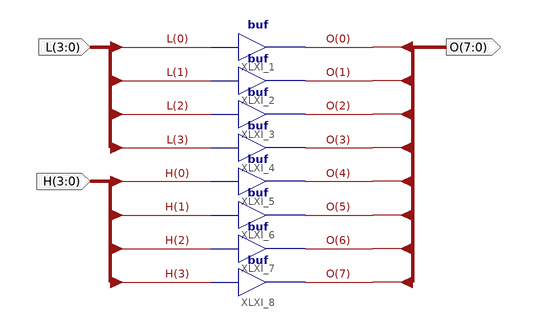
[diagram p0: schematic sheet 1]
// Xilinx ISE schematic splice4x4x8.sch (spartan6) as structural Verilog: 8 symbols, 3 ports
module splice4x4x8 (
  input  [3:0] H,
  input  [3:0] L,
  output [7:0] O
);

  buf XLXI_1 (O[0], L[0]);
  buf XLXI_2 (O[1], L[1]);
  buf XLXI_3 (O[2], L[2]);
  buf XLXI_4 (O[3], L[3]);
  buf XLXI_5 (O[4], H[0]);
  buf XLXI_6 (O[5], H[1]);
  buf XLXI_7 (O[6], H[2]);
  buf XLXI_8 (O[7], H[3]);
endmodule
